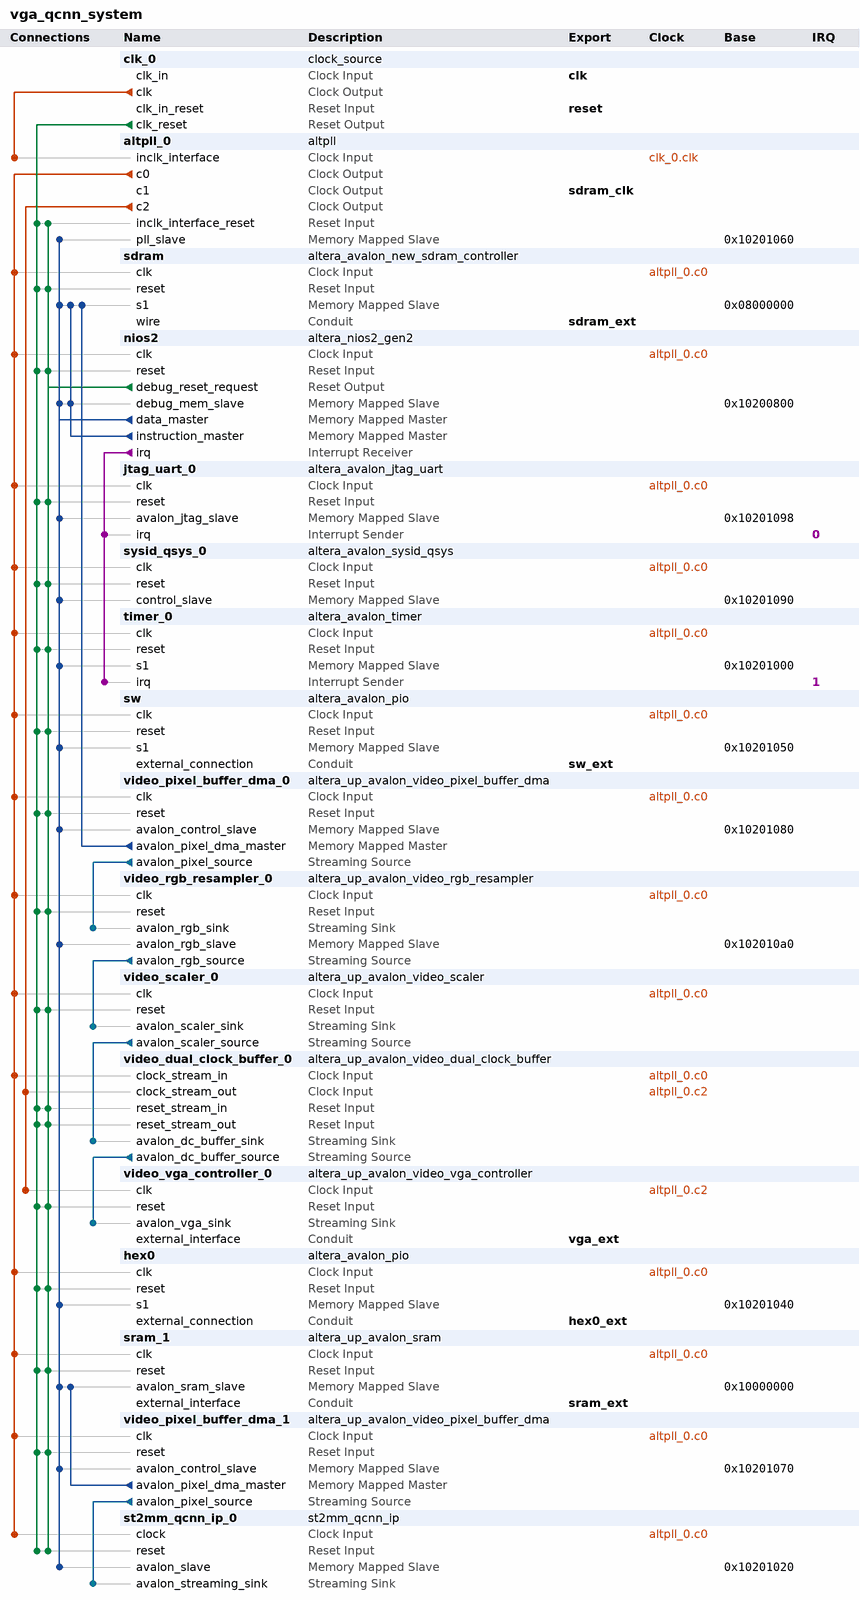
[diagram p0: system contents]
# Platform Designer (Qsys) system vga_qcnn_system, Cyclone IV E EP4CE115F29C7
# Parameters at their usual value, and those the tool derives, are not listed.
package require -exact qsys 18.1
create_system vga_qcnn_system
set_project_property DEVICE_FAMILY {Cyclone IV E}
set_project_property DEVICE EP4CE115F29C7

add_instance clk_0 clock_source 18.1
set_instance_parameter_value clk_0 clockFrequency 50000000

add_instance altpll_0 altpll 18.1
set_instance_parameter_value altpll_0 CLK0_DIVIDE_BY 1
set_instance_parameter_value altpll_0 CLK0_MULTIPLY_BY 2
set_instance_parameter_value altpll_0 CLK1_DIVIDE_BY 1
set_instance_parameter_value altpll_0 CLK1_DUTY_CYCLE 50
set_instance_parameter_value altpll_0 CLK1_MULTIPLY_BY 2
set_instance_parameter_value altpll_0 CLK1_PHASE_SHIFT -3000
set_instance_parameter_value altpll_0 CLK2_DIVIDE_BY 2
set_instance_parameter_value altpll_0 CLK2_DUTY_CYCLE 50
set_instance_parameter_value altpll_0 CLK2_MULTIPLY_BY 1
set_instance_parameter_value altpll_0 CLK2_PHASE_SHIFT 0
set_instance_parameter_value altpll_0 INCLK0_INPUT_FREQUENCY 20000
set_instance_parameter_value altpll_0 PORT_ARESET PORT_UNUSED
set_instance_parameter_value altpll_0 PORT_LOCKED PORT_UNUSED
set_instance_parameter_value altpll_0 PORT_clk1 PORT_USED
set_instance_parameter_value altpll_0 PORT_clk2 PORT_USED
set_instance_parameter_value altpll_0 PORT_clk3 PORT_UNUSED

add_instance sdram altera_avalon_new_sdram_controller 18.1
set_instance_parameter_value sdram TAC 5.5
set_instance_parameter_value sdram TRCD 20.0
set_instance_parameter_value sdram TRP 20.0
set_instance_parameter_value sdram casLatency 3
set_instance_parameter_value sdram columnWidth 10
set_instance_parameter_value sdram dataWidth 32
set_instance_parameter_value sdram generateSimulationModel false
set_instance_parameter_value sdram model single_Micron_MT48LC4M32B2_7_chip
set_instance_parameter_value sdram numberOfBanks 4
set_instance_parameter_value sdram numberOfChipSelects 1
set_instance_parameter_value sdram powerUpDelay 200.0
set_instance_parameter_value sdram refreshPeriod 7.8125
set_instance_parameter_value sdram rowWidth 13

add_instance nios2 altera_nios2_gen2 18.1
set_instance_parameter_value nios2 dcache_size 2048
set_instance_parameter_value nios2 exceptionSlave sdram.s1
set_instance_parameter_value nios2 icache_size 4096
set_instance_parameter_value nios2 impl Tiny
set_instance_parameter_value nios2 resetSlave sdram.s1

add_instance jtag_uart_0 altera_avalon_jtag_uart 18.1
set_instance_parameter_value jtag_uart_0 simInteractiveOptions NO_INTERACTIVE_WINDOWS

add_instance sysid_qsys_0 altera_avalon_sysid_qsys 18.1
set_instance_parameter_value sysid_qsys_0 id 0

add_instance timer_0 altera_avalon_timer 18.1
set_instance_parameter_value timer_0 period 1
set_instance_parameter_value timer_0 periodUnits MSEC

add_instance sw altera_avalon_pio 18.1
set_instance_parameter_value sw direction Input
set_instance_parameter_value sw width 18

add_instance video_pixel_buffer_dma_0 altera_up_avalon_video_pixel_buffer_dma 18.0
set_instance_parameter_value video_pixel_buffer_dma_0 addr_mode X-Y
set_instance_parameter_value video_pixel_buffer_dma_0 back_start_address 0
set_instance_parameter_value video_pixel_buffer_dma_0 color_space {16-bit RGB}
set_instance_parameter_value video_pixel_buffer_dma_0 image_height 240
set_instance_parameter_value video_pixel_buffer_dma_0 image_width 320
set_instance_parameter_value video_pixel_buffer_dma_0 start_address 268435456

add_instance video_rgb_resampler_0 altera_up_avalon_video_rgb_resampler 18.0
set_instance_parameter_value video_rgb_resampler_0 alpha 1023
set_instance_parameter_value video_rgb_resampler_0 input_type {16-bit RGB}
set_instance_parameter_value video_rgb_resampler_0 output_type {30-bit RGB}

add_instance video_scaler_0 altera_up_avalon_video_scaler 18.0
set_instance_parameter_value video_scaler_0 color_bits 10
set_instance_parameter_value video_scaler_0 color_planes 3
set_instance_parameter_value video_scaler_0 height_scaling 2
set_instance_parameter_value video_scaler_0 width_in 320
set_instance_parameter_value video_scaler_0 width_scaling 2

add_instance video_dual_clock_buffer_0 altera_up_avalon_video_dual_clock_buffer 18.0
set_instance_parameter_value video_dual_clock_buffer_0 color_bits 10

add_instance video_vga_controller_0 altera_up_avalon_video_vga_controller 18.0
set_instance_parameter_value video_vga_controller_0 board DE2-115
set_instance_parameter_value video_vga_controller_0 resolution {VGA 640x480}

add_instance hex0 altera_avalon_pio 18.1
set_instance_parameter_value hex0 direction Output
set_instance_parameter_value hex0 resetValue 255
set_instance_parameter_value hex0 width 8

add_instance sram_1 altera_up_avalon_sram 18.0
set_instance_parameter_value sram_1 board DE2-115
set_instance_parameter_value sram_1 pixel_buffer false

add_instance video_pixel_buffer_dma_1 altera_up_avalon_video_pixel_buffer_dma 18.0
set_instance_parameter_value video_pixel_buffer_dma_1 addr_mode X-Y
set_instance_parameter_value video_pixel_buffer_dma_1 back_start_address 0
set_instance_parameter_value video_pixel_buffer_dma_1 color_space {8-bit Grayscale}
set_instance_parameter_value video_pixel_buffer_dma_1 image_height 26
set_instance_parameter_value video_pixel_buffer_dma_1 image_width 28
set_instance_parameter_value video_pixel_buffer_dma_1 start_address 0

add_instance st2mm_qcnn_ip_0 st2mm_qcnn_ip 1.0
set_instance_parameter_value st2mm_qcnn_ip_0 IMG_H 26
set_instance_parameter_value st2mm_qcnn_ip_0 IMG_W 28
set_instance_parameter_value st2mm_qcnn_ip_0 SCALE_NUM 1
set_instance_parameter_value st2mm_qcnn_ip_0 SHIFT 0
set_instance_parameter_value st2mm_qcnn_ip_0 SINK_FORMAT 0
set_instance_parameter_value st2mm_qcnn_ip_0 X0 128
set_instance_parameter_value st2mm_qcnn_ip_0 Y0 0

# connections
add_connection altpll_0.c0 hex0.clk clock
add_connection altpll_0.c0 jtag_uart_0.clk clock
add_connection altpll_0.c0 nios2.clk clock
add_connection altpll_0.c0 sdram.clk clock
add_connection altpll_0.c0 sram_1.clk clock
add_connection altpll_0.c0 st2mm_qcnn_ip_0.clock clock
add_connection altpll_0.c0 sw.clk clock
add_connection altpll_0.c0 sysid_qsys_0.clk clock
add_connection altpll_0.c0 timer_0.clk clock
add_connection altpll_0.c0 video_dual_clock_buffer_0.clock_stream_in clock
add_connection altpll_0.c0 video_pixel_buffer_dma_0.clk clock
add_connection altpll_0.c0 video_pixel_buffer_dma_1.clk clock
add_connection altpll_0.c0 video_rgb_resampler_0.clk clock
add_connection altpll_0.c0 video_scaler_0.clk clock
add_connection altpll_0.c2 video_dual_clock_buffer_0.clock_stream_out clock
add_connection altpll_0.c2 video_vga_controller_0.clk clock
add_connection clk_0.clk altpll_0.inclk_interface clock
add_connection clk_0.clk_reset altpll_0.inclk_interface_reset reset
add_connection clk_0.clk_reset hex0.reset reset
add_connection clk_0.clk_reset jtag_uart_0.reset reset
add_connection clk_0.clk_reset nios2.reset reset
add_connection clk_0.clk_reset sdram.reset reset
add_connection clk_0.clk_reset sram_1.reset reset
add_connection clk_0.clk_reset st2mm_qcnn_ip_0.reset reset
add_connection clk_0.clk_reset sw.reset reset
add_connection clk_0.clk_reset sysid_qsys_0.reset reset
add_connection clk_0.clk_reset timer_0.reset reset
add_connection clk_0.clk_reset video_dual_clock_buffer_0.reset_stream_in reset
add_connection clk_0.clk_reset video_dual_clock_buffer_0.reset_stream_out reset
add_connection clk_0.clk_reset video_pixel_buffer_dma_0.reset reset
add_connection clk_0.clk_reset video_pixel_buffer_dma_1.reset reset
add_connection clk_0.clk_reset video_rgb_resampler_0.reset reset
add_connection clk_0.clk_reset video_scaler_0.reset reset
add_connection clk_0.clk_reset video_vga_controller_0.reset reset
add_connection nios2.debug_reset_request altpll_0.inclk_interface_reset reset
add_connection nios2.debug_reset_request hex0.reset reset
add_connection nios2.debug_reset_request jtag_uart_0.reset reset
add_connection nios2.debug_reset_request nios2.reset reset
add_connection nios2.debug_reset_request sdram.reset reset
add_connection nios2.debug_reset_request sram_1.reset reset
add_connection nios2.debug_reset_request st2mm_qcnn_ip_0.reset reset
add_connection nios2.debug_reset_request sw.reset reset
add_connection nios2.debug_reset_request sysid_qsys_0.reset reset
add_connection nios2.debug_reset_request timer_0.reset reset
add_connection nios2.debug_reset_request video_dual_clock_buffer_0.reset_stream_in reset
add_connection nios2.debug_reset_request video_dual_clock_buffer_0.reset_stream_out reset
add_connection nios2.debug_reset_request video_pixel_buffer_dma_0.reset reset
add_connection nios2.debug_reset_request video_pixel_buffer_dma_1.reset reset
add_connection nios2.debug_reset_request video_rgb_resampler_0.reset reset
add_connection nios2.debug_reset_request video_scaler_0.reset reset
add_connection nios2.debug_reset_request video_vga_controller_0.reset reset
add_connection nios2.data_master altpll_0.pll_slave avalon
set_connection_parameter_value nios2.data_master/altpll_0.pll_slave baseAddress 0x10201060
add_connection nios2.data_master hex0.s1 avalon
set_connection_parameter_value nios2.data_master/hex0.s1 baseAddress 0x10201040
add_connection nios2.data_master jtag_uart_0.avalon_jtag_slave avalon
set_connection_parameter_value nios2.data_master/jtag_uart_0.avalon_jtag_slave baseAddress 0x10201098
add_connection nios2.data_master nios2.debug_mem_slave avalon
set_connection_parameter_value nios2.data_master/nios2.debug_mem_slave baseAddress 0x10200800
add_connection nios2.data_master sdram.s1 avalon
set_connection_parameter_value nios2.data_master/sdram.s1 baseAddress 0x08000000
add_connection nios2.data_master sram_1.avalon_sram_slave avalon
set_connection_parameter_value nios2.data_master/sram_1.avalon_sram_slave baseAddress 0x10000000
add_connection nios2.data_master st2mm_qcnn_ip_0.avalon_slave avalon
set_connection_parameter_value nios2.data_master/st2mm_qcnn_ip_0.avalon_slave baseAddress 0x10201020
add_connection nios2.data_master sw.s1 avalon
set_connection_parameter_value nios2.data_master/sw.s1 baseAddress 0x10201050
add_connection nios2.data_master sysid_qsys_0.control_slave avalon
set_connection_parameter_value nios2.data_master/sysid_qsys_0.control_slave baseAddress 0x10201090
add_connection nios2.data_master timer_0.s1 avalon
set_connection_parameter_value nios2.data_master/timer_0.s1 baseAddress 0x10201000
add_connection nios2.data_master video_pixel_buffer_dma_0.avalon_control_slave avalon
set_connection_parameter_value nios2.data_master/video_pixel_buffer_dma_0.avalon_control_slave baseAddress 0x10201080
add_connection nios2.data_master video_pixel_buffer_dma_1.avalon_control_slave avalon
set_connection_parameter_value nios2.data_master/video_pixel_buffer_dma_1.avalon_control_slave baseAddress 0x10201070
add_connection nios2.data_master video_rgb_resampler_0.avalon_rgb_slave avalon
set_connection_parameter_value nios2.data_master/video_rgb_resampler_0.avalon_rgb_slave baseAddress 0x102010a0
add_connection nios2.instruction_master nios2.debug_mem_slave avalon
set_connection_parameter_value nios2.instruction_master/nios2.debug_mem_slave baseAddress 0x10200800
add_connection nios2.instruction_master sdram.s1 avalon
set_connection_parameter_value nios2.instruction_master/sdram.s1 baseAddress 0x08000000
add_connection video_pixel_buffer_dma_0.avalon_pixel_dma_master sdram.s1 avalon
set_connection_parameter_value video_pixel_buffer_dma_0.avalon_pixel_dma_master/sdram.s1 baseAddress 0x08000000
add_connection video_pixel_buffer_dma_1.avalon_pixel_dma_master sram_1.avalon_sram_slave avalon
set_connection_parameter_value video_pixel_buffer_dma_1.avalon_pixel_dma_master/sram_1.avalon_sram_slave baseAddress 0x10000000
add_connection video_dual_clock_buffer_0.avalon_dc_buffer_source video_vga_controller_0.avalon_vga_sink avalon_streaming
add_connection video_pixel_buffer_dma_0.avalon_pixel_source video_rgb_resampler_0.avalon_rgb_sink avalon_streaming
add_connection video_pixel_buffer_dma_1.avalon_pixel_source st2mm_qcnn_ip_0.avalon_streaming_sink avalon_streaming
add_connection video_rgb_resampler_0.avalon_rgb_source video_scaler_0.avalon_scaler_sink avalon_streaming
add_connection video_scaler_0.avalon_scaler_source video_dual_clock_buffer_0.avalon_dc_buffer_sink avalon_streaming
add_connection nios2.irq jtag_uart_0.irq interrupt
set_connection_parameter_value nios2.irq/jtag_uart_0.irq irqNumber 0
add_connection nios2.irq timer_0.irq interrupt
set_connection_parameter_value nios2.irq/timer_0.irq irqNumber 1

# exported interfaces
add_interface clk clock sink
set_interface_property clk EXPORT_OF clk_0.clk_in
add_interface hex0_ext conduit end
set_interface_property hex0_ext EXPORT_OF hex0.external_connection
add_interface reset reset sink
set_interface_property reset EXPORT_OF clk_0.clk_in_reset
add_interface sdram_clk clock source
set_interface_property sdram_clk EXPORT_OF altpll_0.c1
add_interface sdram_ext conduit end
set_interface_property sdram_ext EXPORT_OF sdram.wire
add_interface sram_ext conduit end
set_interface_property sram_ext EXPORT_OF sram_1.external_interface
add_interface sw_ext conduit end
set_interface_property sw_ext EXPORT_OF sw.external_connection
add_interface vga_ext conduit end
set_interface_property vga_ext EXPORT_OF video_vga_controller_0.external_interface

set_interconnect_requirement {$system} qsys_mm.clockCrossingAdapter HANDSHAKE
set_interconnect_requirement {$system} qsys_mm.enableEccProtection FALSE
set_interconnect_requirement {$system} qsys_mm.insertDefaultSlave FALSE
set_interconnect_requirement {$system} qsys_mm.maxAdditionalLatency 1

save_system vga_qcnn_system.qsys
